# EasyEDA Pro project SMPS_V1.epro, schematic Schematic2_1
Board Name: LV; Create Date: 2026-02-08; Page Name: P1; Project Name: TL494-PSU-V1; Schematic Name: Schematic2; Update Date: 2026-03-06; Company: EasyEDA.com; Page Size: A4; Version: V1.0
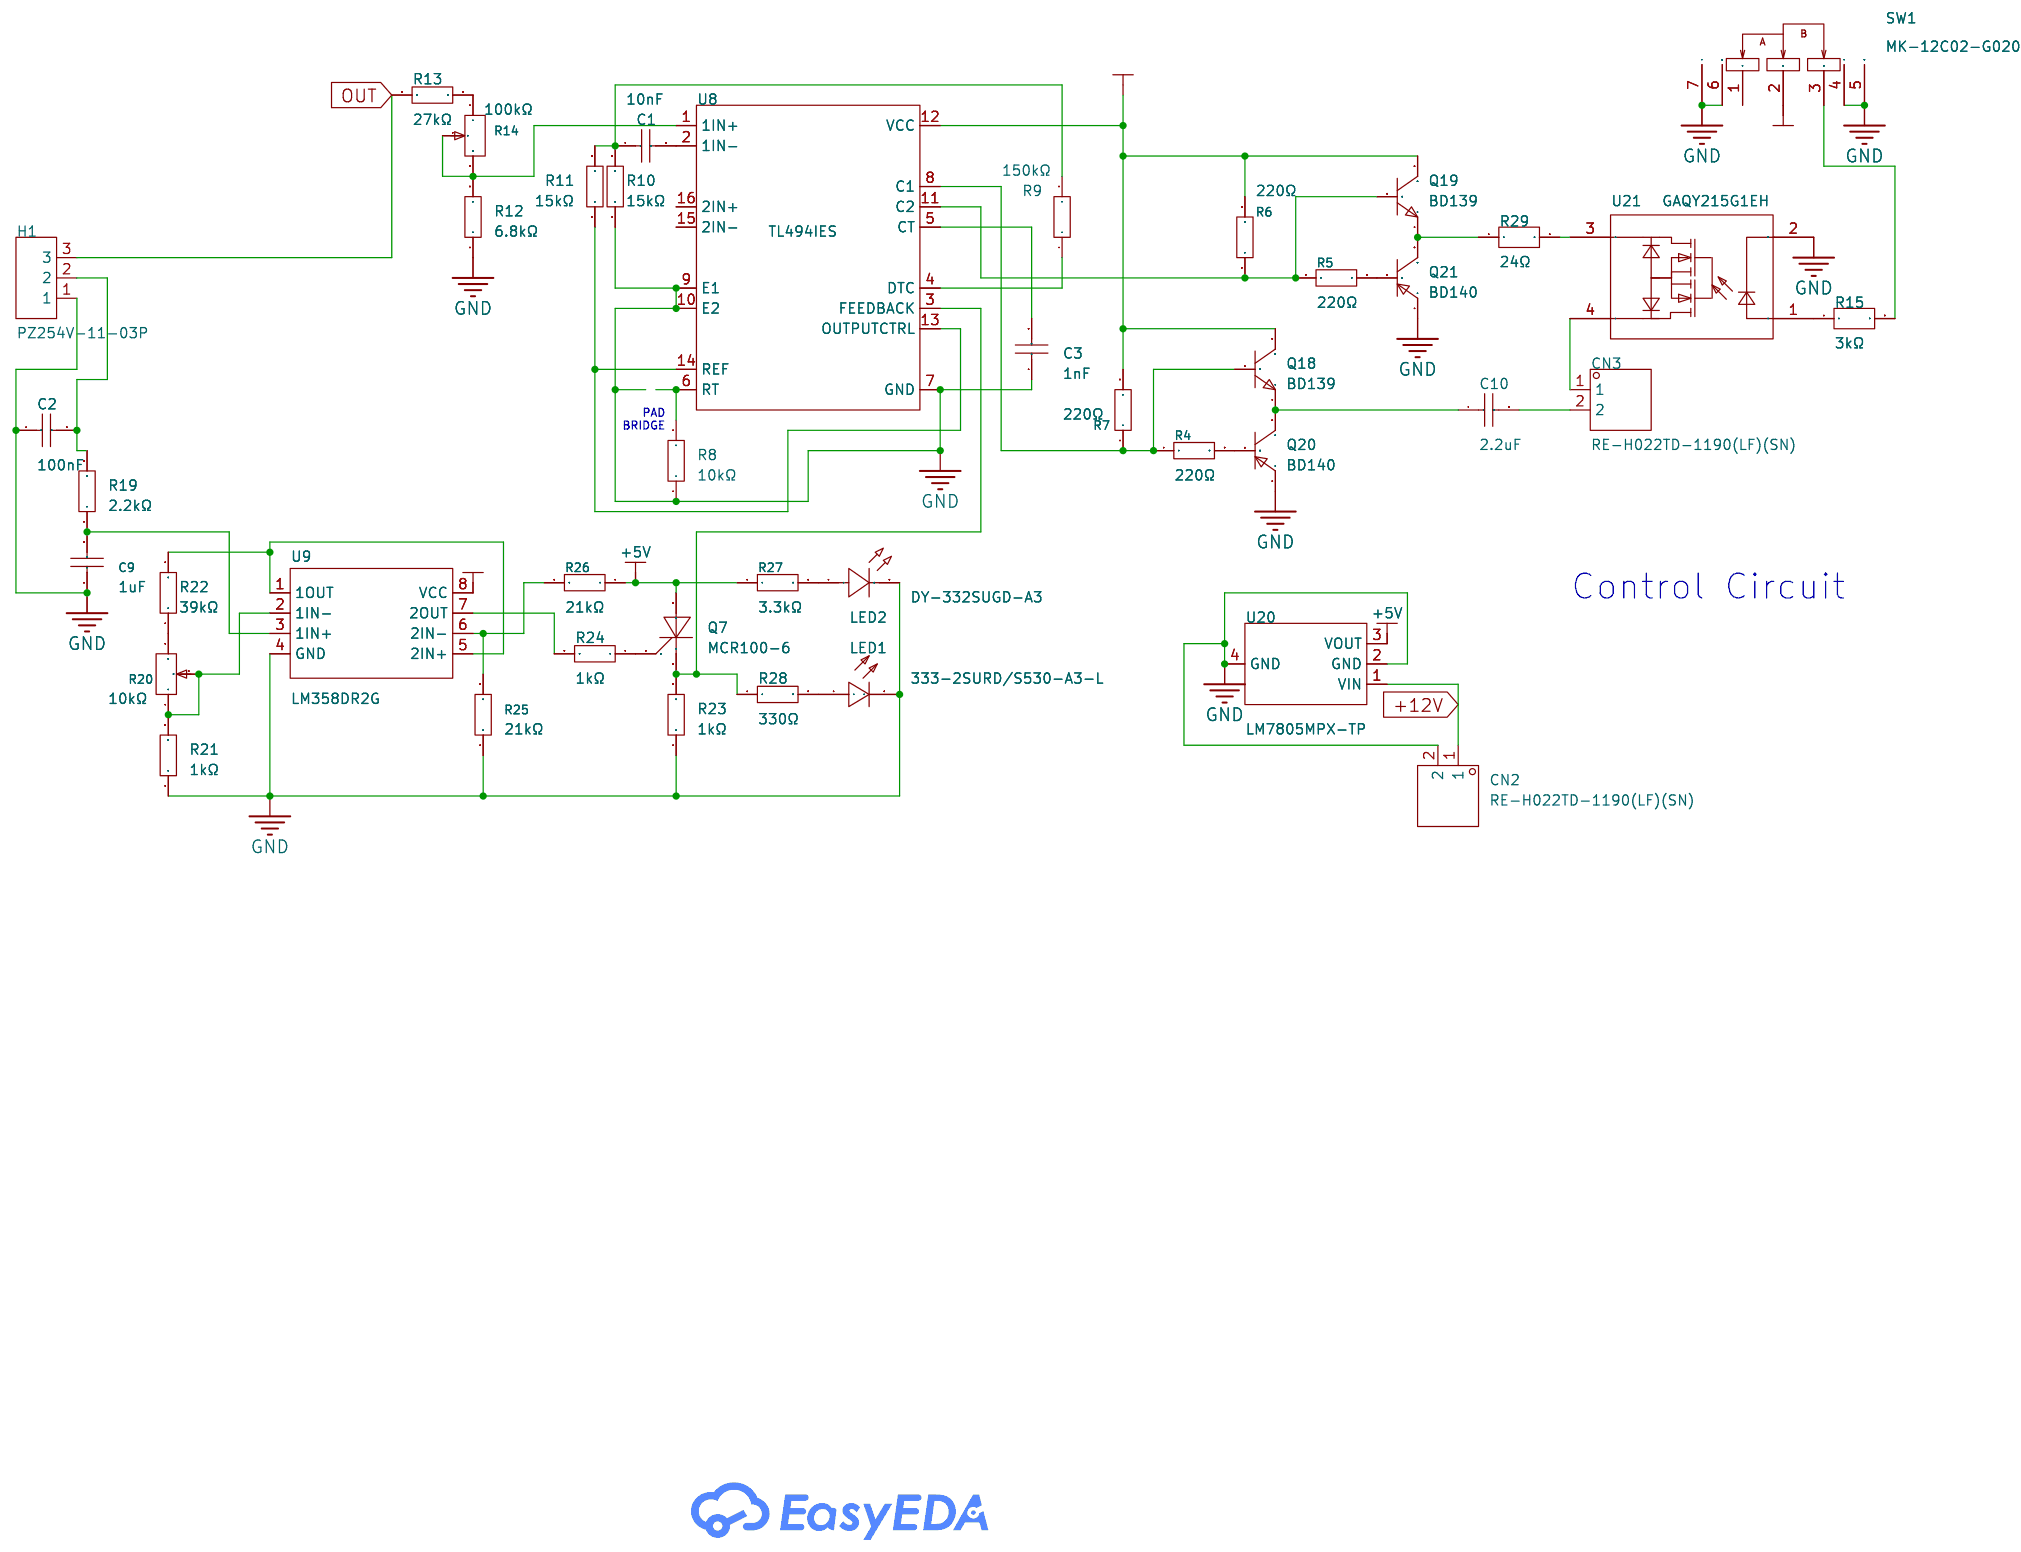
[diagram p10: schematic sheet]

## Parts
C1  10nF  [C0603]
C2  100nF  [C0805]
C3  1nF  [C0603]
C9  1uF  [C0805]
C10  2.2uF  [C1210]
CN2  RE-H022TD-1190(LF)(SN)  [HDR-TH_2P-P2.54-V-M-1]
CN3  RE-H022TD-1190(LF)(SN)  [HDR-TH_2P-P2.54-V-M-1]
H1  PZ254V-11-03P  [HDR-TH_3P-P2.54-V-M_PZ254V-11-03P]
LED1  333-2SURD/S530-A3-L  [LED-TH_BD5.0-P2.54-FD_RED]
LED2  DY-332SUGD-A3  [LED-TH_BD5.9-P2.54-FD]
Q7  MCR100-6  [SOT-23-3_L2.9-W1.3-P1.90-LS2.4-BR-CW]
Q18  BD139  [TO-126-3_L7.6-W2.7-P2.30-L]
Q19  BD139  [TO-126-3_L7.6-W2.7-P2.30-L]
Q20  BD140  [TO-126-3_L7.6-W2.7-P2.30-L]
Q21  BD140  [TO-126-3_L7.6-W2.7-P2.30-L]
R4  220Ω  [R0603]
R5  220Ω  [R0603]
R6  220Ω  [R0603]
R7  220Ω  [R0603]
R8  10kΩ  [R0603]
R9  150kΩ  [R0603]
R10  15kΩ  [R0603]
R11  15kΩ  [R0603]
R12  6.8kΩ  [R0603]
R13  27kΩ  [R0603]
R14  100kΩ  [RES-ADJ-TH_3296W]
R15  3kΩ  [R1206]
R19  2.2kΩ  [R0603]
R20  10kΩ  [RES-ADJ-TH_3296W]
R21  1kΩ  [R0603]
R22  39kΩ  [R0603]
R23  1kΩ  [R0603]
R24  1kΩ  [R0603]
R25  21kΩ  [R0603]
R26  21kΩ  [R0603]
R27  3.3kΩ  [R0603]
R28  330Ω  [R0603]
R29  24Ω  [R2512]
SW1  MK-12C02-G020  [SW-SMD_MK-12C02-G020]
U8  TL494IES  [SOP-16_L10.0-W4.0-P1.27-LS6.0-BL]
U9  LM358DR2G  [SOIC-8_L5.0-W4.0-P1.27-LS6.0-BL]
U20  LM7805MPX-TP  [SOT-223-4_L6.5-W3.5-P2.30-LS7.0-BR]
U21  GAQY215G1EH  [SOP-4_L6.4-W4.6-P2.54-LS10.2-BR]

## Library data of the parts
C1 = 0603B103K101NT: Capacitance:10nF Tolerance:±10% Tolerance:±10% Voltage Rating:100V Temperature Coefficient:X7R; LCSC Part Name: 10nF ±10% 100V; Supplier Part: C43253; Manufacturer: FH(风华); Supplier Footprint: 0603; JLCPCB Part Class: Extended Part; Datasheet: https://item.szlcsc.com/datasheet/0603B103K101NT/44244.html; Supplier: LCSC; Tolerance: ±10%; Voltage Rating: 100V; Temperature Coefficient: X7R
C2 = CL21B104KCFNNNE: Capacitance:100nF Tolerance:±10% Tolerance:±10% Voltage Rating:100V Temperature Coefficient:X7R; LCSC Part Name: 100nF ±10% 100V; Supplier Part: C28233; Manufacturer: SAMSUNG(三星); Supplier Footprint: 0805; JLCPCB Part Class: Basic Part; Datasheet: https://item.szlcsc.com/datasheet/CL21B104KCFNNNE/28983.html; Supplier: LCSC; Tolerance: ±10%; Voltage Rating: 100V; Temperature Coefficient: X7R
C3 = CC0603KRX7R0BB102: Capacitance: Tolerance:±10% Tolerance:±10% Voltage Rated: Temperature Coefficient:; LCSC Part Name: 1nF ±10% 100V; Supplier Part: C106247; Manufacturer: YAGEO(国巨); Supplier Footprint: 0603; JLCPCB Part Class: Extended Part; Datasheet: https://atta.szlcsc.com/upload/public/pdf/source/20170505/1493957846281.pdf; Supplier: LCSC; Tolerance: ±10%
C9 = CL21B105KBFNNNE: Capacitance:1uF Tolerance:±10% Tolerance:±10% Voltage Rating:50V Temperature Coefficient:X7R; LCSC Part Name: 1uF ±10% 50V; Supplier Part: C28323; Manufacturer: SAMSUNG(三星); Supplier Footprint: 0805; JLCPCB Part Class: Basic Part; Datasheet: https://item.szlcsc.com/datasheet/CL21B105KBFNNNE/29074.html; Supplier: LCSC; Tolerance: ±10%; Voltage Rating: 50V; Temperature Coefficient: X7R
C10 = CL32B225KCJSNNE: Capacitance:2.2uF Tolerance:±10% Tolerance:±10% Voltage Rating:100V Temperature Coefficient:X7R; LCSC Part Name: 2.2uF ±10% 100V; Supplier Part: C55151; Manufacturer: SAMSUNG(三星); Supplier Footprint: 1210; JLCPCB Part Class: Extended Part; Datasheet: https://item.szlcsc.com/datasheet/CL32B225KCJSNNE/56177.html; Supplier: LCSC; Tolerance: ±10%; Voltage Rating: 100V; Temperature Coefficient: X7R
CN2 CN3 = RE-H022TD-1190(LF)(SN): Pins Structure:1x2P Pitch:2.54mm Mounting Type:Through Hole Number of Pins:2P Number of Rows:1 Number of PINs Per Row:2 Current Rating:3A Contact Material:Brass Operating Temperature:-55℃~+125℃ Operating Temperature:-55℃~+125℃ Voltage Rating:250V Plastic; LCSC Part Name: 1x2P 间距:2.54mm 直插; Supplier Part: C160332; Manufacturer: JST; Supplier Footprint: 插件,P=2.54mm; JLCPCB Part Class: Extended Part; Datasheet: https://item.szlcsc.com/datasheet/RE-H022TD-1190(LF)(SN)/171712.html; Supplier: LCSC; Pins Structure: 1x2P; Pitch: 2.54mm; Mounting Type: Through Hole; Number of Pins: 2P; Number of Rows: 1; Number of PINs Per Row: 2; Current Rating: 3A; Contact Material: Brass; Operating Temperature: -55℃~+125℃; Voltage Rating: 250V; Plastic Material: PBT; Flame Retardant Rating: UL94V-0; Color: Black
H1 = PZ254V-11-03P: Pin Structure:1x3P Pitch:2.54mm Row Spacing:- Circluar Pins/Square Pins:Pin Header Mounting Type:Through Hole Number of Rows:1 Number of Pins:3P Current Rating:3A Voltage Rating (Max):250V Length of Mating Pin:6mm Insulation Height:2.5mm Length of End Con; LCSC Part Name: 1x3P 间距:2.54mm 方针 直插; Supplier Part: C2937625; Manufacturer: XFCN(兴飞); Supplier Footprint: 插件,P=2.54mm; JLCPCB Part Class: Extended Part; Datasheet: https://item.szlcsc.com/datasheet/PZ254V-11-03P/3293280.html; Supplier: LCSC; Pin Structure: 1x3P; Pitch: 2.54mm; Circluar Pins/Square Pins: Pin Header; Mounting Type: Through Hole; Number of Rows: 1; Number of Pins: 3P; Current Rating: 3A; Voltage Rating (Max): 250V; Length of Mating Pin: 6mm; Insulation Height: 2.5mm; Length of End Connection Pin: 3mm; Operating Temperature: -40℃~+105℃; Color: Black
LED1 = 333-2SURD/S530-A3-L: Lamp Holder Type:5mm Round Lens Illumination Color:Red Voltage - Forward(Vf):2.4V Voltage - Forward(Vf):2.4V Power(Watts):60mW Forward Current:20mA Wavelength - Dominant:624nm Wavelength - Dominant:624nm Peak Wavelength:632nm Luminous Intensity:200mcd Lum; LCSC Part Name: 红灯; Supplier Part: C99758; Manufacturer: EVERLIGHT(亿光); Supplier Footprint: 插件,D=5mm; JLCPCB Part Class: Extended Part; Datasheet: https://www.everlight.com.cn/wp-content/plugins/ItemRelationship/product_files/pdf/A203B-SUR-S530-A3.pdf; Supplier: LCSC; Lamp Holder Type: 5mm Round Lens; Illumination Color: Red; Voltage - Forward(Vf): 2.4V; Power(Watts): 60mW; Forward Current: 20mA; Wavelength - Dominant: 624nm; Peak Wavelength: 632nm; Luminous Intensity: 200mcd; Viewing Angle: 30°; Operating Temperature: -40℃~+85℃
LED2 = DY-332SUGD-A3: Illumination Color:Green Voltage - Forward(Vf):3.4V Voltage - Forward(Vf):3.4V Power(Watts):70mW Forward Current:20mA Wavelength - Dominant:514nm~524nm Wavelength - Dominant:514nm~524nm Peak Wavelength:513.5nm Viewing Angle:66° Operating Temperature:-25℃~; LCSC Part Name: 5mm圆头有边翠绿色; Supplier Part: C7470788; Manufacturer: TONYU(东裕); Supplier Footprint: D=5mm; JLCPCB Part Class: Extended Part; Datasheet: https://item.szlcsc.com/datasheet/DY-332SUGD-A3/8521754.html; Supplier: LCSC; Illumination Color: Green; Voltage - Forward(Vf): 3.4V; Power(Watts): 70mW; Forward Current: 20mA; Wavelength - Dominant: 514nm~524nm; Peak Wavelength: 513.5nm; Viewing Angle: 66°; Operating Temperature: -25℃~+80℃
Q7 = MCR100-6_C5184415: SCR Type:- Gate Trigger   Voltage (Vgt):800mV Holding Current (Ih):5mA Peak off - state voltage(Vdrm):400V Current - Gate Trigger(Igt):60uA Voltage - On State(Vtm):1.7V Current - Surge(Itsm@f):8A Average Gate Power Dissipation (PG(AV)):100mW Current - On; LCSC Part Name: 单向 Vgt: 800mV IT:0.8A Vdrm: 400V; Supplier Part: C5184415; Manufacturer: HXY MOSFET(华轩阳电子); Supplier Footprint: SOT-23; JLCPCB Part Class: Extended Part; Datasheet: https://item.szlcsc.com/datasheet/MCR100-6/5849851.html; Supplier: LCSC; Gate Trigger   Voltage (Vgt): 800mV; Holding Current (Ih): 5mA; Peak off - state voltage(Vdrm): 400V; Current - Gate Trigger(Igt): 60uA; Voltage - On State(Vtm): 1.7V; Current - Surge(Itsm@f): 8A; Average Gate Power Dissipation (PG(AV)): 100mW; Current - On State(It(RMS)): 800mA
Q18 Q19 = BD139(RANGE:100-250): type:NPN Current - Collector(Ic):1.5A Collector - Emitter Voltage VCEO:80V Pd - Power Dissipation:1.25W DC Current Gain:250@150mA,2V DC Current Gain:250@150mA,2V Current - Collector Cutoff:100nA Vce Saturation(VCE(sat)):500mV@500mA,50mA Emitter-Base Volta; LCSC Part Name: 100-250 NPN 电流:1.5A 电压:80V; Supplier Part: C2973796; Manufacturer: CJ(江苏长电/长晶); Supplier Footprint: TO-126-3; JLCPCB Part Class: Extended Part; Datasheet: https://item.szlcsc.com/datasheet/BD139(RANGE%253A100-250)/3371037.html; Supplier: LCSC; type: NPN; Current - Collector(Ic): 1.5A; Collector - Emitter Voltage VCEO: 80V; Pd - Power Dissipation: 1.25W; DC Current Gain: 250@150mA,2V; Current - Collector Cutoff: 100nA; Vce Saturation(VCE(sat)): 500mV@500mA,50mA; Emitter-Base Voltage(Vebo): 5V; Number: 1 NPN
Q20 Q21 = BD140: type:PNP Current - Collector(Ic):1.5A Collector - Emitter Voltage VCEO:80V Pd - Power Dissipation:1.25W DC Current Gain:40@150mA,2V DC Current Gain:40@150mA,2V Transition frequency(fT):- Current - Collector Cutoff:100nA Vce Saturation(VCE(sat)):500mV@500m; LCSC Part Name: PNP 电流:1.5A 电压:80V; Supplier Part: C20604; Manufacturer: CJ(江苏长电/长晶); Supplier Footprint: TO-126; JLCPCB Part Class: Extended Part; Datasheet: https://item.szlcsc.com/datasheet/BD140/21316.html; Supplier: LCSC; type: PNP; Current - Collector(Ic): 1.5A; Collector - Emitter Voltage VCEO: 80V; Pd - Power Dissipation: 1.25W; DC Current Gain: 40@150mA,2V; Current - Collector Cutoff: 100nA; Vce Saturation(VCE(sat)): 500mV@500mA,50mA; Operating Temperature: -55℃~+150℃; Emitter-Base Voltage(Vebo): 5V; Number: 1 PNP
R4-R7 = 0603WAF2200T5E: Type:Thick Film Resistors Resistance: Tolerance:±1% Tolerance:±1% Power(Watts): Overload Voltage (Max): Temperature Coefficient:±100ppm/℃ Temperature Coefficient:±100ppm/℃ Operating Temperature Range:-55℃~+155℃ Operating Temperature Range:-55℃~+155℃; LCSC Part Name: 220Ω ±1% 100mW 厚膜电阻; Supplier Part: C22962; Manufacturer: UNI-ROYAL(厚声); Supplier Footprint: 0603; JLCPCB Part Class: Basic Part; Datasheet: https://atta.szlcsc.com/upload/public/pdf/source/20200306/C422600_1E6D84923E4A46A82E41ADD87F860B5C.pdf; Supplier: LCSC; Type: Thick Film Resistors; Tolerance: ±1%; Temperature Coefficient: ±100ppm/℃; Operating Temperature Range: -55℃~+155℃
R8 = RC0603FR-0710KL: Type:Thick Film Resistors Resistance: Tolerance:±1% Tolerance:±1% Power(Watts): Overload Voltage (Max): Temperature Coefficient:±100ppm/℃ Temperature Coefficient:±100ppm/℃ Operating Temperature Range:-55℃~+155℃ Operating Temperature Range:-55℃~+155℃; LCSC Part Name: 厚膜电阻 10kΩ ±1% 100mW; Supplier Part: C98220; Manufacturer: YAGEO(国巨); Supplier Footprint: 0603; JLCPCB Part Class: Extended Part; Datasheet: https://atta.szlcsc.com/upload/public/pdf/source/20180927/C295883_E8D83085EA81BD7DE0B2B681138C15EE.pdf; Supplier: LCSC; Type: Thick Film Resistors; Tolerance: ±1%; Temperature Coefficient: ±100ppm/℃; Operating Temperature Range: -55℃~+155℃
R9 = RC0603FR-07150KL: Type:Thick Film Resistors Resistance: Tolerance:±1% Tolerance:±1% Power(Watts): Overload Voltage (Max): Temperature Coefficient:±100ppm/℃ Temperature Coefficient:±100ppm/℃ Operating Temperature Range:-55℃~+155℃ Operating Temperature Range:-55℃~+155℃; LCSC Part Name: 厚膜电阻 150kΩ ±1% 100mW; Supplier Part: C114660; Manufacturer: YAGEO(国巨); Supplier Footprint: 0603; JLCPCB Part Class: Extended Part; Datasheet: https://atta.szlcsc.com/upload/public/pdf/source/20180821/C275644_0D56F95EFF785E7D9A1FEF436B37DA78.pdf; Supplier: LCSC; Type: Thick Film Resistors; Tolerance: ±1%; Temperature Coefficient: ±100ppm/℃; Operating Temperature Range: -55℃~+155℃
R10 R11 = RC0603FR-0715KL: Type:Thick Film Resistor Resistance:15kΩ Tolerance:±1% Tolerance:±1% Power(Watts):100mW Voltage-Supply(Max):75V Temperature Coefficient:±100ppm/℃ Temperature Coefficient:±100ppm/℃ Operating Temperature:-55℃~+155℃ Operating Temperature:-55℃~+155℃; LCSC Part Name: 厚膜电阻 15kΩ ±1% 100mW; Supplier Part: C114661; Manufacturer: YAGEO(国巨); Supplier Footprint: 0603; JLCPCB Part Class: Extended Part; Datasheet: https://item.szlcsc.com/datasheet/RC0603FR-0715KL/115905.html; Supplier: LCSC; Type: Thick Film Resistor; Tolerance: ±1%; Power(Watts): 100mW; Voltage-Supply(Max): 75V; Temperature Coefficient: ±100ppm/℃; Operating Temperature: -55℃~+155℃
R12 = RC0603FR-076K8L: Type:Thick Film Resistor Resistance:6.8kΩ Tolerance:±1% Tolerance:±1% Power(Watts):100mW Voltage-Supply(Max):75V Temperature Coefficient:±100ppm/℃ Temperature Coefficient:±100ppm/℃ Operating Temperature:-55℃~+155℃ Operating Temperature:-55℃~+155℃; LCSC Part Name: 厚膜电阻 6.8kΩ ±1% 100mW; Supplier Part: C114632; Manufacturer: YAGEO(国巨); Supplier Footprint: 0603; JLCPCB Part Class: Extended Part; Datasheet: https://item.szlcsc.com/datasheet/RC0603FR-076K8L/115876.html; Supplier: LCSC; Type: Thick Film Resistor; Tolerance: ±1%; Power(Watts): 100mW; Voltage-Supply(Max): 75V; Temperature Coefficient: ±100ppm/℃; Operating Temperature: -55℃~+155℃
R13 = RC0603FR-0727KL: Type:Thick Film Resistor Resistance:27kΩ Tolerance:±1% Tolerance:±1% Power(Watts):100mW Voltage-Supply(Max):75V Temperature Coefficient:±100ppm/℃ Temperature Coefficient:±100ppm/℃ Operating Temperature:-55℃~+155℃ Operating Temperature:-55℃~+155℃; LCSC Part Name: 厚膜电阻 27kΩ ±1% 100mW; Supplier Part: C114614; Manufacturer: YAGEO(国巨); Supplier Footprint: 0603; JLCPCB Part Class: Extended Part; Datasheet: https://item.szlcsc.com/datasheet/RC0603FR-0727KL/115858.html; Supplier: LCSC; Type: Thick Film Resistor; Tolerance: ±1%; Power(Watts): 100mW; Voltage-Supply(Max): 75V; Temperature Coefficient: ±100ppm/℃; Operating Temperature: -55℃~+155℃
R14 = 3296W-1-104-8mm: Resistance:100kΩ Tolerance:±10% Tolerance:±10% Power(Watts):500mW Temperature Coefficient:±250ppm/℃ Temperature Coefficient:±250ppm/℃ Number of Turns:30; LCSC Part Name: 100kΩ ±10%; Supplier Part: C330435; Manufacturer: BOCHEN(博晨); Supplier Footprint: 插件-3P,9.5x4.9mm; JLCPCB Part Class: Extended Part; Datasheet: https://item.szlcsc.com/datasheet/3296W-1-104-8mm/310165.html; Supplier: LCSC; Tolerance: ±10%; Power(Watts): 500mW; Temperature Coefficient: ±250ppm/℃; Number of Turns: 30
R15 = FRC1206J302 TS: Type:Thick Film Resistor Resistance:3kΩ Tolerance:±5% Tolerance:±5% Power(Watts):250mW Voltage-Supply(Max):200V Temperature Coefficient:±100ppm/℃ Temperature Coefficient:±100ppm/℃ Operating Temperature:-55℃~+155℃ Operating Temperature:-55℃~+155℃; LCSC Part Name: 3kΩ ±5% 250mW 厚膜电阻; Supplier Part: C2907493; Manufacturer: FOJAN(富捷); Supplier Footprint: 1206; JLCPCB Part Class: Extended Part; Supplier: LCSC; Type: Thick Film Resistor; Tolerance: ±5%; Power(Watts): 250mW; Voltage-Supply(Max): 200V; Temperature Coefficient: ±100ppm/℃; Operating Temperature: -55℃~+155℃
R19 = RC0603FR-072K2L: Type:Thick Film Resistor Resistance:2.2kΩ Tolerance:±1% Tolerance:±1% Power(Watts):100mW Voltage-Supply(Max):75V Temperature Coefficient:±100ppm/℃ Temperature Coefficient:±100ppm/℃ Operating Temperature:-55℃~+155℃ Operating Temperature:-55℃~+155℃; LCSC Part Name: 厚膜电阻 2.2kΩ ±1% 100mW; Supplier Part: C114662; Manufacturer: YAGEO(国巨); Supplier Footprint: 0603; JLCPCB Part Class: Extended Part; Datasheet: https://item.szlcsc.com/datasheet/RC0603FR-072K2L/115906.html; Supplier: LCSC; Type: Thick Film Resistor; Tolerance: ±1%; Power(Watts): 100mW; Voltage-Supply(Max): 75V; Temperature Coefficient: ±100ppm/℃; Operating Temperature: -55℃~+155℃
R20 = 3296W-1-103-8mm: Resistance:10kΩ Tolerance:±10% Tolerance:±10% Power(Watts):500mW Temperature Coefficient:±250ppm/℃ Temperature Coefficient:±250ppm/℃ Number of Turns:30; LCSC Part Name: 10kΩ ±10%; Supplier Part: C330432; Manufacturer: BOCHEN(博晨); Supplier Footprint: 插件-3P,9.5x4.9mm; JLCPCB Part Class: Extended Part; Datasheet: https://item.szlcsc.com/datasheet/3296W-1-103-8mm/310162.html; Supplier: LCSC; Tolerance: ±10%; Power(Watts): 500mW; Temperature Coefficient: ±250ppm/℃; Number of Turns: 30
R21 R23 R24 = RC0603FR-071KL: Type:Thick Film Resistor Resistance:1kΩ Tolerance:±1% Tolerance:±1% Power(Watts):100mW Voltage-Supply(Max):75V Temperature Coefficient:±100ppm/℃ Temperature Coefficient:±100ppm/℃ Operating Temperature:-55℃~+155℃ Operating Temperature:-55℃~+155℃; LCSC Part Name: 厚膜电阻 1kΩ ±1% 100mW; Supplier Part: C22548; Manufacturer: YAGEO(国巨); Supplier Footprint: 0603; JLCPCB Part Class: Extended Part; Datasheet: https://item.szlcsc.com/datasheet/RC0603FR-071KL/23274.html; Supplier: LCSC; Type: Thick Film Resistor; Tolerance: ±1%; Power(Watts): 100mW; Voltage-Supply(Max): 75V; Temperature Coefficient: ±100ppm/℃; Operating Temperature: -55℃~+155℃
R22 = RC0603FR-0739KL: Type:Thick Film Resistors Resistance: Tolerance:±1% Tolerance:±1% Power(Watts): Overload Voltage (Max): Temperature Coefficient:±100ppm/℃ Temperature Coefficient:±100ppm/℃ Operating Temperature Range:-55℃~+155℃ Operating Temperature Range:-55℃~+155℃; LCSC Part Name: 厚膜电阻 39kΩ ±1% 100mW; Supplier Part: C163424; Manufacturer: YAGEO(国巨); Supplier Footprint: 0603; JLCPCB Part Class: Extended Part; Datasheet: https://atta.szlcsc.com/upload/public/pdf/source/20181009/C309620_DA5935B6E1D48212CB7A533FE518B3C2.pdf; Supplier: LCSC; Type: Thick Film Resistors; Tolerance: ±1%; Temperature Coefficient: ±100ppm/℃; Operating Temperature Range: -55℃~+155℃
R25 R26 = 0603WAF2102T5E: Type:Thick Film Resistor Resistance:21kΩ Tolerance:±1% Tolerance:±1% Power(Watts):100mW Voltage-Supply(Max):75V Temperature Coefficient:±100ppm/℃ Temperature Coefficient:±100ppm/℃ Operating Temperature:-55℃~+155℃ Operating Temperature:-55℃~+155℃; LCSC Part Name: 21kΩ ±1% 100mW 厚膜电阻; Supplier Part: C22956; Manufacturer: UNI-ROYAL(厚声); Supplier Footprint: 0603; JLCPCB Part Class: Extended Part; Datasheet: https://item.szlcsc.com/datasheet/0603WAF2102T5E/23683.html; Supplier: LCSC; Type: Thick Film Resistor; Tolerance: ±1%; Power(Watts): 100mW; Voltage-Supply(Max): 75V; Temperature Coefficient: ±100ppm/℃; Operating Temperature: -55℃~+155℃
R27 = 0603WAF3301T5E: Type:Thick Film Resistor Resistance:3.3kΩ Tolerance:±1% Tolerance:±1% Power(Watts):100mW Voltage-Supply(Max):75V Temperature Coefficient:±100ppm/℃ Temperature Coefficient:±100ppm/℃ Operating Temperature:-55℃~+155℃ Operating Temperature:-55℃~+155℃; LCSC Part Name: 3.3kΩ ±1% 100mW 厚膜电阻; Supplier Part: C22978; Manufacturer: UNI-ROYAL(厚声); Supplier Footprint: 0603; JLCPCB Part Class: Basic Part; Datasheet: https://item.szlcsc.com/datasheet/0603WAF3301T5E/23705.html; Supplier: LCSC; Type: Thick Film Resistor; Tolerance: ±1%; Power(Watts): 100mW; Voltage-Supply(Max): 75V; Temperature Coefficient: ±100ppm/℃; Operating Temperature: -55℃~+155℃
R28 = 0603WAF3300T5E: Type:Thick Film Resistors Resistance: Tolerance:±1% Tolerance:±1% Power(Watts): Overload Voltage (Max): Temperature Coefficient:±100ppm/℃ Temperature Coefficient:±100ppm/℃ Operating Temperature Range:-55℃~+155℃ Operating Temperature Range:-55℃~+155℃; LCSC Part Name: 330Ω ±1% 100mW 厚膜电阻; Supplier Part: C23138; Manufacturer: UNI-ROYAL(厚声); Supplier Footprint: 0603; JLCPCB Part Class: Basic Part; Datasheet: https://atta.szlcsc.com/upload/public/pdf/source/20200306/C422600_1E6D84923E4A46A82E41ADD87F860B5C.pdf; Supplier: LCSC; Type: Thick Film Resistors; Tolerance: ±1%; Temperature Coefficient: ±100ppm/℃; Operating Temperature Range: -55℃~+155℃
R29 = 352224RFT: Type:Thick Film Resistor Resistance:24Ω Tolerance:±1% Tolerance:±1% Power(Watts):3W Voltage-Supply(Max):250V Temperature Coefficient:±200ppm/℃ Temperature Coefficient:±200ppm/℃ Operating Temperature:-55℃~+155℃ Operating Temperature:-55℃~+155℃; LCSC Part Name: 厚膜电阻 24Ω ±1% 3W; Supplier Part: C2076353; Manufacturer: TE Connectivity(泰科电子); Supplier Footprint: 2512; JLCPCB Part Class: Extended Part; Datasheet: https://item.szlcsc.com/datasheet/352224RFT/2167939.html; Supplier: LCSC; Type: Thick Film Resistor; Tolerance: ±1%; Power(Watts): 3W; Voltage-Supply(Max): 250V; Temperature Coefficient: ±200ppm/℃; Operating Temperature: -55℃~+155℃
SW1 = MK-12C02-G020: Circuit:SPDT Actuator Style:Rectangular Columnar Termination Style:- Length:6.6mm Width:1.4mm Switch Height:4.7mm Mounting Type:Surface Mount, Right Angle Actuator Color:Black Current Rating:1A Voltage Rating:6V Life:10,000 Cycles Operating Temperature:-2; LCSC Part Name: 微型拨动开关; Supplier Part: C963206; Manufacturer: G-Switch(品赞); Supplier Footprint: SMD,6.6x1.4mm; JLCPCB Part Class: Extended Part; Datasheet: https://item.szlcsc.com/datasheet/MK-12C02-G020/1046841.html; Supplier: LCSC; Circuit: SPDT; Actuator Style: Rectangular Columnar; Length: 6.6mm; Width: 1.4mm; Switch Height: 4.7mm; Mounting Type: Surface Mount, Right Angle; Actuator Color: Black; Current Rating: 1A; Voltage Rating: 6V; Life: 10,000 Cycles; Operating Temperature: -20℃~+70℃
U8 = TL494IES: Supplier Part: C51927322; Manufacturer: GMIC(绿微); Supplier Footprint: SOP-16; JLCPCB Part Class: Extended Part; Datasheet: https://item.szlcsc.com/datasheet/TL494IES/54633860.html; Supplier: LCSC
U9 = LM358DR2G: Number of Channels:Dual Maximum Power Supply Range (Vdd-Vss):32V Rail to Rail:- Gain Bandwidth Product:- Vos - Input Offset Voltage:7mV Input Offset Voltage Drift(Vos TC):10uV/℃ Slew Rate:- Ib - Input Bias Current:150nA Input Offset Current(Ios):- Noise d; Supplier Part: C7950; Manufacturer: onsemi(安森美); Supplier Footprint: SOIC-8; JLCPCB Part Class: Basic Part; Datasheet: https://item.szlcsc.com/datasheet/LM358DR2G/8427.html; Supplier: LCSC; Number of Channels: Dual; Maximum Power Supply Range (Vdd-Vss): 32V; Vos - Input Offset Voltage: 7mV; Input Offset Voltage Drift(Vos TC): 10uV/℃; Ib - Input Bias Current: 150nA; Common Mode Rejection Ratio(CMRR): 70dB; Operating Temperature: 0℃~+70℃; Single supply: 3V~32V; Dual Supply: -16V~16V
U20 = LM7805MPX-TP: Output Type:Fixed Output Voltage:5V Output Voltage:5V Power Supply Rejection Ratio (PSRR):62dB@(120Hz) Voltage Dropout:2V@(1A) standby current:8mA Features:Short Circuit Protection；Over Temperature Protection Operating Temperature:0℃~+125℃ Operating Tempe; LCSC Part Name: 1.5A 固定电压稳压器; Supplier Part: C41348209; Manufacturer: TECH PUBLIC(台舟); Supplier Footprint: SOT-223; JLCPCB Part Class: Extended Part; Datasheet: https://item.szlcsc.com/datasheet/LM7805MPX-TP/43078140.html; Supplier: LCSC; Output Type: Fixed; Output Voltage: 5V; Power Supply Rejection Ratio (PSRR): 62dB@(120Hz); Voltage Dropout: 2V@(1A); standby current: 8mA; Features: Short Circuit Protection；Over Temperature Protection; Operating Temperature: 0℃~+125℃; Output Configuration: Positive; Number of Outputs: 1
U21 = GAQY215G1EH: Contact Form:1A (SPST-NO) Load Current:1.1A Load Voltage:150V Load Voltage:150V Voltage - Forward(Vf):1.2V Forward Current(If):50mA RDS(on):450mΩ Isolation Voltage(Vrms):5kV Turn-on time:1.5ms Turn-off time:80us Input Type:AC,DC Operating Temperature:-40℃; LCSC Part Name: 1 Form A(SPST-NO)负载电压:150V 连续负载电流:1.1A; Supplier Part: C48606611; Manufacturer: SUPSiC(国晶微半导体); Supplier Footprint: SMD-4P; JLCPCB Part Class: Extended Part; Datasheet: https://item.szlcsc.com/datasheet/GAQY215G1EH/50881729.html; Supplier: LCSC; Contact Form: 1A (SPST-NO); Load Current: 1.1A; Load Voltage: 150V; Voltage - Forward(Vf): 1.2V; Forward Current(If): 50mA; RDS(on): 450mΩ; Isolation Voltage(Vrms): 5kV; Turn-on time: 1.5ms; Turn-off time: 80us; Input Type: AC,DC; Operating Temperature: -40℃~+85℃; Total Power Dissipation(Pd): 400mW

## Nets
+5V: Q7.2(A) R26.1 R27.1 U20.3(VOUT)
+12V: CN2.1 Q18.2(C) Q19.2(C) R6.2 R7.2 SW1.2 U8.12(VCC) U9.8(VCC) U20.1(VIN)
GND: C2.1 C3.1 C9.1 CN2.2 H1.1 LED1.2(K) LED2.2(C) Q20.1(E) Q21.1(E) R8.1 R10.1 R12.1 R21.1 R23.1 R25.1 SW1.4 SW1.5 SW1.6 SW1.7 U8.7(GND) U8.9(E1) U8.10(E2) U9.4(GND) U20.2(GND) U20.4(GND) U21.2
OUT: H1.3 R13.1
$1N1723: LED1.1(A) R28.2
$1N1726: Q7.1(K) R23.2 R28.1 U8.3(FEEDBACK)
$1N1727: LED2.1(A) R27.2
$1N1738: Q19.3(B) R5.1 R6.1 U8.11(C2)
$1N1739: R9.1 U8.4(DTC)
$1N1740: C3.2 U8.5(CT)
$1N1741: Q18.3(B) R4.1 R7.1 U8.8(C1)
$1N1742: C1.1 R9.2 R10.2 R11.2
$1N1743: R20.1 R20.2 R21.2 U9.2(1IN-)
$1N1744: R25.2 R26.2 U9.6(2IN-)
$1N1750: R24.2 U9.7(2OUT)
$1N1753: R22.2 U9.1(1OUT) U9.5(2IN+)
$1N1761: Q7.3(G) R24.1
$1N1763: R11.1 U8.13(OUTPUTCTRL) U8.14(REF)
$1N1765: R12.2 R14.2 R14.3 U8.1(1IN+)
$1N1766: C1.2 U8.2(1IN−)
$1N1767: C9.2 R19.1 U9.3(1IN+)
$1N1768: R20.3 R22.1
$1N1769: C2.2 H1.2 R19.2
$1N1779: R13.2 R14.1
$1N4961: Q19.1(E) Q21.2(C) R29.1
$1N5073: C10.1 Q18.1(E) Q20.2(C)
$1N5076: C10.2 CN3.2
$1N5162: CN3.1 U21.4
$1N5165: R29.2 U21.3
$1N5384: R15.2 SW1.3
$1N5500: R15.1 U21.1
$1N5584: R8.2 U8.6(RT)
$1N8127: Q20.3(B) R4.2
$1N8173: Q21.3(B) R5.2

Not connected (* = marked no-connect by the designer): SW1 1; U8 15(2IN−) 16(2IN+)

## Notes on the sheet
- PAD
  BRIDGE
- Control Circuit
